# EAGLE design Kompass_MainframePTH (EAGLE 9.3.0)

## Sheet 1 of 2
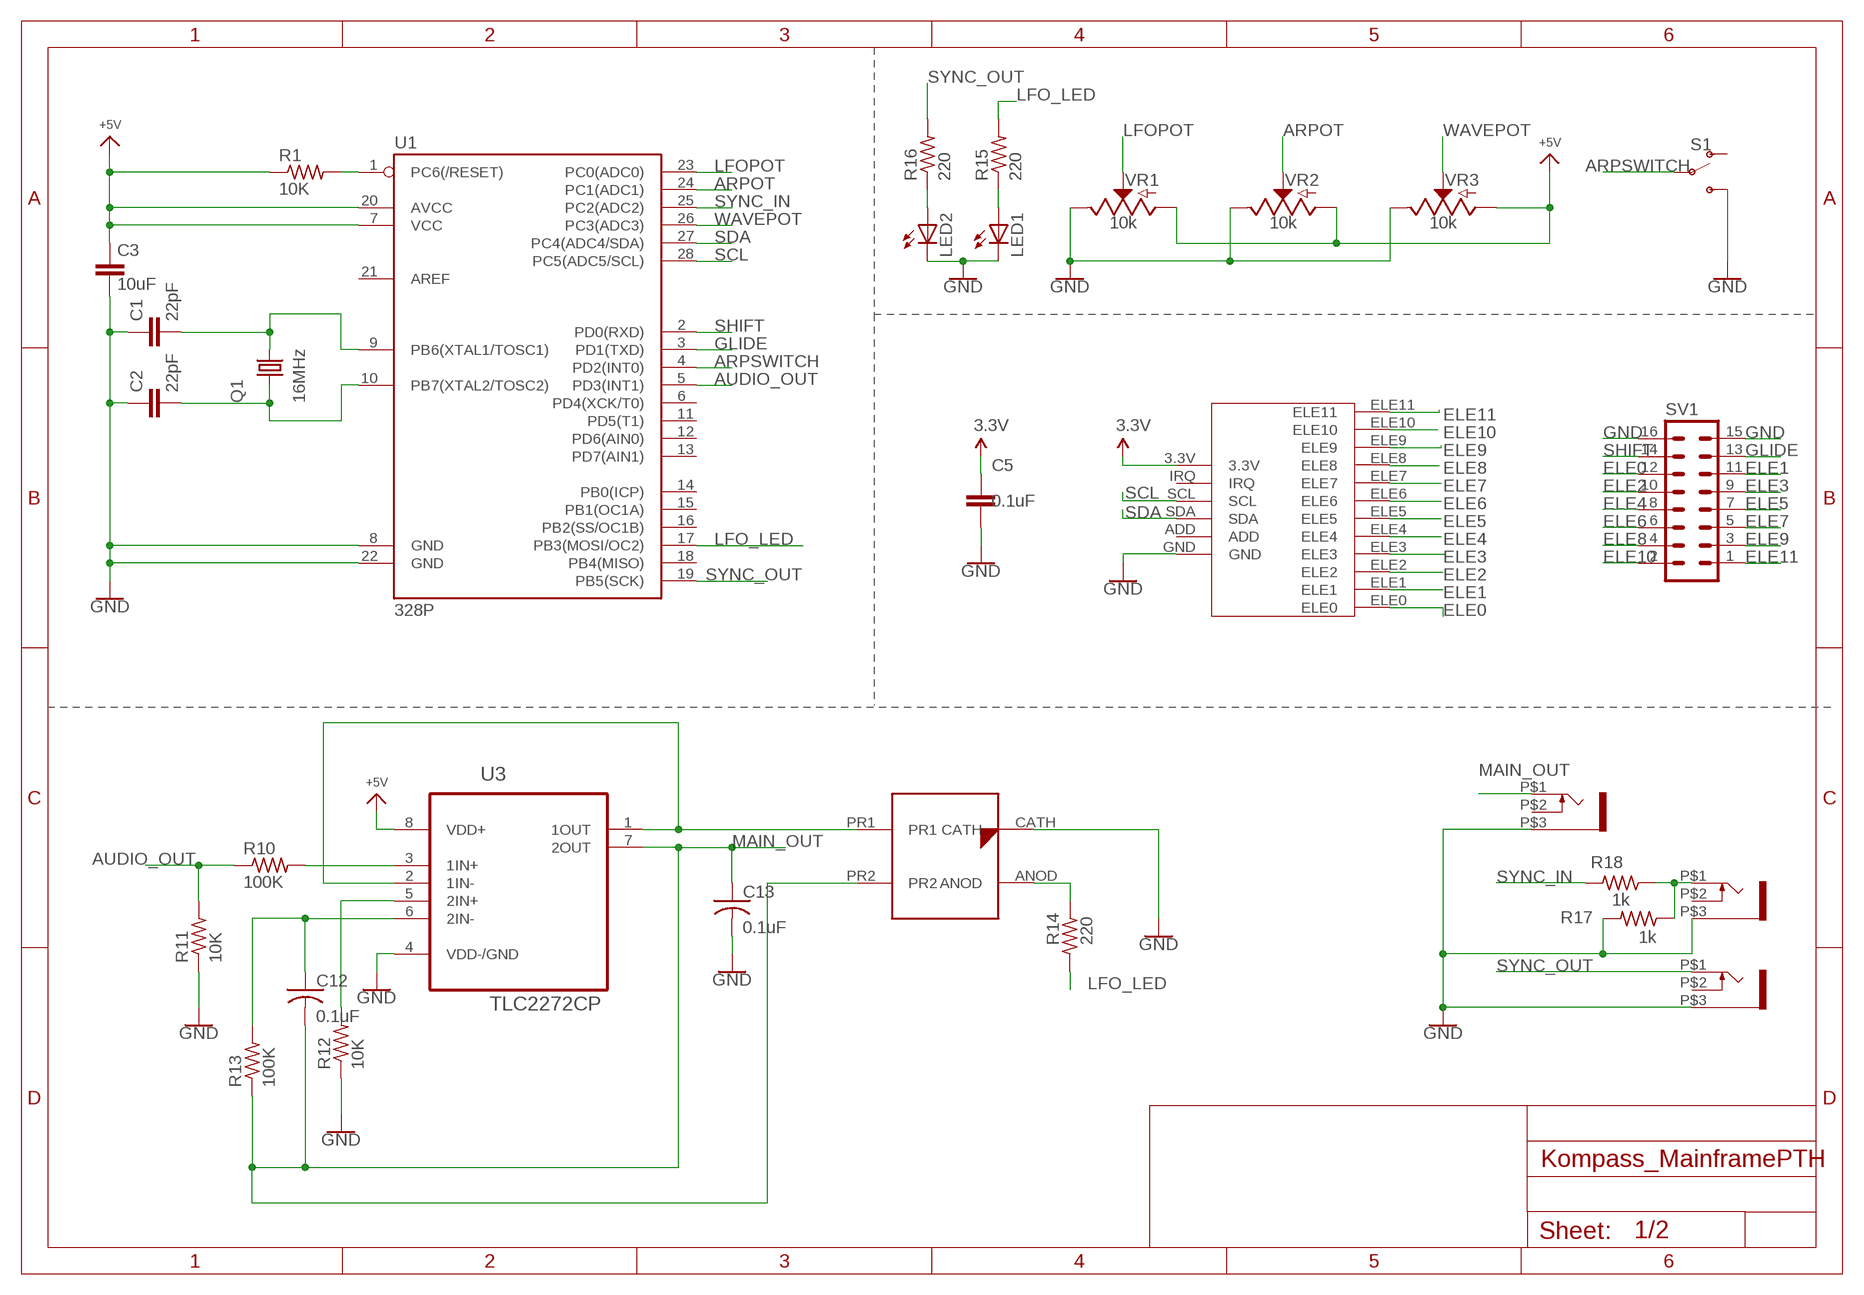
[diagram p0: schematic, sheet 1]

### Parts
C1  22pF  C2,5-3  [C2.5-3]
C2  22pF  C2,5-3  [C2.5-3]
C3  10uF  C-EU025-025X050  [C025-025X050]
C5  0.1uF  C2,5-3  [C2.5-3]
C12  0.1uF  C-US025-024X044  [C025-024X044]
C13  0.1uF  C-US025-024X044  [C025-024X044]
LED1  LED3MM  [LED3MM]
LED2  LED3MM  [LED3MM]
Q1  16MHz  CRYSTALHC49S  [HC49/S]
R1  10K  R-US_0204/5  [0204/5]
R10  100K  R-US_0204/5  [0204/5]
R11  10K  R-US_0204/5  [0204/5]
R12  10K  R-US_0204/5  [0204/5]
R13  100K  R-US_0204/5  [0204/5]
R14  220  R-US_0204/5  [0204/5]
R15  220  R-US_0204/5  [0204/5]
R16  220  R-US_0204/5  [0204/5]
R17  1k  R-US_0204/5  [0204/5]
R18  1k  R-US_0204/5  [0204/5]
S1  SWITCH-SPDT-PTH-11.6X4.0MM  [SWITCH_SPDT_PTH_11.6X4.0MM]
SV1  MA08-2  [MA08-2]
U1  328P  ATMEGA328P_PDIP  [DIP28]
U3  TLC2272CP  [DIP254P762X508-8]
U$1  BOCUMA_VACTROLBMA_VACTROL_PTH  [BOCUMA_VACTROL]
U$2  WQP-PJ301M-12_JACK  [WQP-PJ301M-12_JACK]
U$3  WQP-PJ301M-12_JACK  [WQP-PJ301M-12_JACK]
U$4  WQP-PJ301M-12_JACK  [WQP-PJ301M-12_JACK]
U$6  MPR121_BREAKOUT  [MPR121_BREAKOUT]
VR1  10k  POTENTIOMETER-PTH-9MM-1/20W-20%  [POT-PTH-ALPS]
VR2  10k  POTENTIOMETER-PTH-9MM-1/20W-20%  [POT-PTH-ALPS]
VR3  10k  POTENTIOMETER-PTH-9MM-1/20W-20%  [POT-PTH-ALPS]

### Nets
3.3V: C5.1 U$6.3.3V ; also sheet 2
ARPOT: U1.24(PC1(ADC1)) VR2.P$2(S)
ARPSWITCH: S1.2(P) U1.4(PD2(INT0))
AUDIO_OUT: R10.1 R11.2 U1.5(PD3(INT1))
ELE0: SV1.12 U$6.ELE0
ELE1: SV1.11 U$6.ELE1
ELE2: SV1.10 U$6.ELE2
ELE3: SV1.9 U$6.ELE3
ELE4: SV1.8 U$6.ELE4
ELE5: SV1.7 U$6.ELE5
ELE6: SV1.6 U$6.ELE6
ELE7: SV1.5 U$6.ELE7
ELE8: SV1.4 U$6.ELE8
ELE9: SV1.3 U$6.ELE9
ELE10: SV1.2 U$6.ELE10
ELE11: SV1.1 U$6.ELE11
GLIDE: SV1.13 U1.3(PD1(TXD))
GND: C1.1 C2.1 C3.2 C5.2 C13.2 LED1.K(C) LED2.K(C) R11.1 R12.1 R17.2 S1.3(S) SV1.15 SV1.16 U1.8(GND) U1.22(GND) U3.4(VDD-/GND) U$1.CATH U$2.P$3 U$3.P$3 U$4.P$3 U$6.GND VR1.P$1(E) VR2.P$1(E) VR3.P$1(E) ; also sheet 2
LFO_LED: R14.1 R15.2 U1.17(PB3(MOSI/OC2))
LFOPOT: U1.23(PC0(ADC0)) VR1.P$2(S)
MAIN_OUT: C12.2 C13.1 R13.1 U3.7(2OUT) U$1.PR2 U$4.P$1
N$1: C1.2 Q1.2 U1.9(PB6(XTAL1/TOSC1))
N$2: C2.2 Q1.1 U1.10(PB7(XTAL2/TOSC2))
N$3: R1.2 U1.1(PC6(/RESET))
N$6: C12.1 R13.2 U3.6(2IN-)
N$7: R12.2 U3.5(2IN+)
N$8: U3.1(1OUT) U3.2(1IN-) U$1.PR1
N$9: R10.2 U3.3(1IN+)
N$10: R14.2 U$1.ANOD
N$11: LED1.A R15.1
N$12: LED2.A R16.1
N$13: R17.1 R18.1 U$2.P$1
SCL: U1.28(PC5(ADC5/SCL)) U$6.SCL
SDA: U1.27(PC4(ADC4/SDA)) U$6.SDA
SHIFT: SV1.14 U1.2(PD0(RXD))
SYNC_IN: R18.2 U1.25(PC2(ADC2))
SYNC_OUT: R16.2 U1.19(PB5(SCK)) U$3.P$1
VCC: C3.1 R1.1 U1.7(VCC) U1.20(AVCC) U3.8(VDD+) VR1.P$3(A) VR2.P$3(A) VR3.P$3(A) ; supply symbol labelled +5V ; also sheet 2
WAVEPOT: U1.26(PC3(ADC3)) VR3.P$2(S)
Unconnected: S1.1(O) U1.6(PD4(XCK/T0)) U1.11(PD5(T1)) U1.12(PD6(AIN0)) U1.13(PD7(AIN1)) U1.14(PB0(ICP)) U1.15(PB1(OC1A)) U1.16(PB2(SS/OC1B)) U1.18(PB4(MISO)) U1.21(AREF) U$2.P$2 U$3.P$2 U$4.P$2 U$6.ADD U$6.IRQ

## Sheet 2 of 2
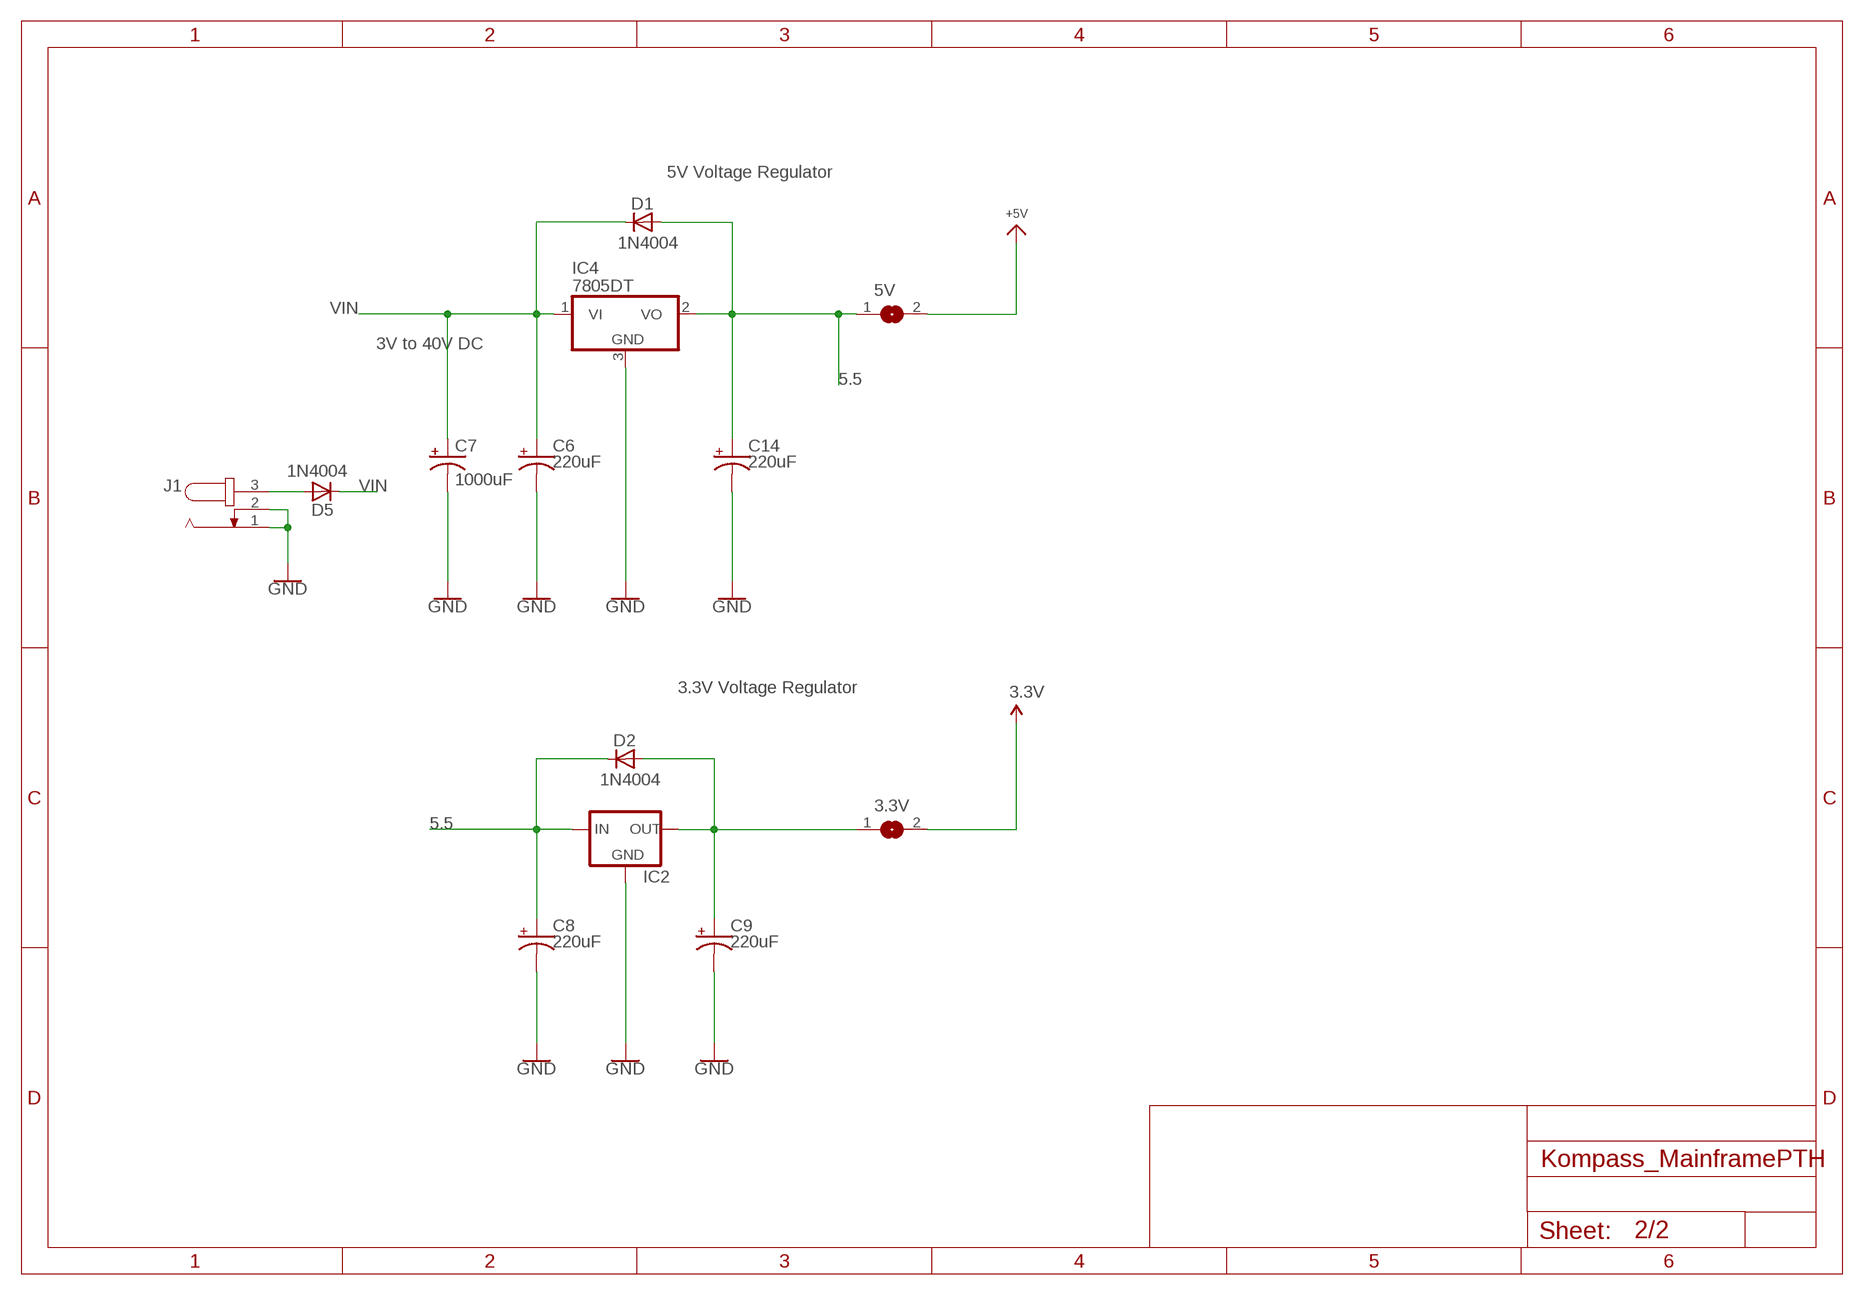
[diagram p1: schematic, sheet 2]

### Parts
3.3V  SJW  [SJW]
5V  SJW  [SJW]
C6  220uF  CPOL-USE2,5-6E  [E2,5-6E]
C7  1000uF  CPOL-USE3.5-8  [E3,5-8]
C8  220uF  CPOL-USE2,5-6E  [E2,5-6E]
C9  220uF  CPOL-USE2,5-6E  [E2,5-6E]
C14  220uF  CPOL-USE2,5-6E  [E2,5-6E]
D1  1N4004  [DO41-10]
D2  1N4004  [DO41-10]
D5  1N4004  [DO41-10]
IC2  78LXX  [78LXX]
IC4  7805DT  [TO252]
J1  JACK-PLUG0  [SPC4077]

### Nets
3.3V: 3.3V.2 ; also sheet 1
5.5: 5V.1 C8.+ C14.+ D1.A D2.C IC2.IN IC4.2(VO)
GND: C6.- C7.- C8.- C9.- C14.- IC2.GND IC4.3(GND) J1.1 J1.2 ; also sheet 1
N$4: D5.A J1.3
N$15: 3.3V.1 C9.+ D2.A IC2.OUT
VCC: 5V.2 ; supply symbol labelled +5V ; also sheet 1
VIN: C6.+ C7.+ D1.C D5.C IC4.1(VI)

### Notes on the sheet
- 5V Voltage Regulator
- 3V to 40V DC
- 3.3V Voltage Regulator

## Library data of the parts
3.3V 5V = jumper:SJ: SMD solder JUMPER
C1 C2 C5 = capacitor-wima:C: CAPACITOR naming: grid - package width
C3 = rcl:C-EU: CAPACITOR, European symbol; SPICEPREFIX: C
C6 C8 C9 C14 = rcl:CPOL-US: POLARIZED CAPACITOR, American symbol; SPICEPREFIX: C
C7 = adafruit:CPOL-US: POLARIZED CAPACITOR, American symbol
C12 C13 = adafruit:C-US: CAPACITOR, American symbol
D1 D2 D5 = adafruit:1N4004: DIODE General purpose 1N400x type rectifier (With bigger pads) http://www.ladyada.net/library/pcb/eaglelibrary.html
IC2 = DC_LOAD_AU:78LXX: VOLTAGE REGULATOR
IC4 = adafruit:78*: Positive VOLTAGE REGULATOR Added bigger pads to the TO-92 package
J1 = con-jack:JACK-PLUG: DC POWER JACK Power Jack, DC, Right Angle, Through Hole, Rated 5A at 16VDC, PC Terminals Distributor: Farnell (www.Farnell.de) Drawing: 84N1161.pdf / 84N1162.pdf Manufacturer: SPC Technology (www.spctechnology.com) Type: SPC4077 / SPC 4078; OC_FARNELL: unknown; OC_NEWARK: unknown
LED1 LED2 = adafruit:LED: LED OSRAM: - CHIPLED LG R971, LG N971, LY N971, LG Q971, LY Q971, LO R971, LY R971 LH N974, LH R974 LS Q976, LO Q976, LY Q976 LO Q996 - Hyper CHIPLED LW Q18S LB Q993, LB Q99A, LB R99A - SideLED LS A670, LO A670, LY A670, LG A670, LP A670 LB A673, LV A673, LT A673, LW A673 LH A674 LY A675 LS A676, LA A676, LO A676, LY A676, LW A676 LS A679, LY A679, LG A679 - Hyper Micro SIDELED® LS Y876, LA Y876, LO Y876, LY Y876 LT Y87S - SmartLED LW L88C, LW L88S LB L89C, LB L89S, LG L890 LS L89K, LO L89K, LY L89K LS L896, LA L896, LO L896, LY L896 - TOPLED LS T670, LO T670, LY T670, LG T670, LP T670 LSG T670, LSP T670, LSY T670, LOP T670, LYG T670 LG T671, LOG T671, LSG T671 LB T673, LV T673, LT T673, LW T673 LH T674 LS T676, LA T676, LO T676, LY T676, LB T676, LH T676, LSB T676, LW T676 LB T67C, LV T67C, LT T67C, LS T67K, LO T67K, LY T67K, LW E67C LS E67B, LA E67B, LO E67B, LY E67B, LB E67C, LV E67C, LT E67C LW T67C LS T679, LY T679, LG T679 LS T770, LO T770, LY T770, LG T770, LP T770 LB T773, LV T773, LT T773, LW T773 LH T774 LS E675, LA E675, LY E675, LS T675 LS T776, LA T776, LO T776, LY T776, LB T776 LHGB T686 LT T68C, LB T68C - Hyper Mini TOPLED® LB M676 - Mini TOPLED Santana® LG M470 LS M47K, LO M47K, LY M47K Source: http://www.osram.convergy.de/
Q1 = crystal:CRYSTAL: CRYSTAL; OC_FARNELL: 1667008; OC_NEWARK: unknown
R1 R10-R18 = adafruit:R-US_: RESISTOR, American symbol
S1 = SparkFun-Switches:SWITCH-SPDT: Single Pole, Double Throw (SPDT) Switch Single-pole, double-throw (SPDT) switch. Variant Overview SMD-AYZ0202 Surface Mount DPDT Switch <https://www.sparkfun.com/products/597> (COM-00597) Used on e.g. LilyPad Arduino USB - ATmega32U4 Board <https://www.sparkfun.com/products/12049> PTH-11.6X4.0MM SPDT Mini Power Switch <https://www.sparkfun.com/products/102> (COM-00102) Used on e.g. SparkFun Simon Says - Through-Hole Soldering Kit <https://www.sparkfun.com/products/10547> (KIT-10547) PTH-11.6X4.0MM-KIT KIT version of SPDT Mini Power Switch - Simplifies soldering by removing tStop of switch pins - only one side can be soldered. PTH-11.6X4.0MM-LOCK LOCK version of SPDT Mini Power Switch - Offset pins hold switch in place for easier soldering. SMD-RIGHT-ANGLE Surface Mount Right Angle Switch <https://www.sparkfun.com/products/10860> (COM-10860) Used on e.g. SparkFun ESP8266 Thing <https://www.sparkfun.com/products/13231>; PROD_ID: SWCH-08261; SF_SKU: COM-00102
SV1 = con-lstb:MA08-2: PIN HEADER; OC_FARNELL: unknown; OC_NEWARK: unknown
U1 = SparkFun-IC-Microcontroller:ATMEGA328P_PDIP: Atmel 328P Through hole ATMEGA328P uC used in the Arduino 32kb flash, 1k EEPROM, 2k SRAM Datasheet <http://www.sparkfun.com/datasheets/Components/SMD/ATMega328.pdf> SparkFun Products Storefront component: AVR 28 Pin 20MHz 32K 6A/D - ATMega328P <https://www.sparkfun.com/products/9061> (COM-09061) SparkFun Simon Says - Through-Hole Soldering Kit <https://www.sparkfun.com/products/10547> (KIT-10547) SparkFun Learn to Solder - Simon Says <https://www.sparkfun.com/products/13708> (KIT-13708) SparkFun BigTime Watch Kit <https://www.sparkfun.com/products/11734> (KIT-11734) SparkFun ClockIt <https://www.sparkfun.com/products/10930> (KIT-10930) SparkFun Serial Enabled LCD Kit <https://www.sparkfun.com/products/10097> (LCD-10097) SparkFun Simon Tilts - Through Hole Soldering Kit <https://www.sparkfun.com/products/12634> (KIT-12634) SparkFun Frequency Counter Kit <https://www.sparkfun.com/products/10140> (KIT-10140) FabFM Radio Kit <https://www.sparkfun.com/products/11043> (KIT-11043) SparkFun Binary Blaster Kit <https://www.sparkfun.com/products/12037> (KIT-12037) SparkFun Metro-Gnome <https://www.sparkfun.com/products/9236> (KIT-09236) ATmega328 with Arduino Optiboot (Uno) <https://www.sparkfun.com/products/10524> (DEV-10524); PROD_ID: IC-09136
U3 = TLC2272CP:TLC2272CP: OPERATIONAL AMPLIFIER; AVAILABILITY: Unavailable; DESCRIPTION: Dual Low-Noise Rail-To-Rail Operational Amplifier 8-PDIP 0 to 70; MF: Texas Instruments; MP: TLC2272CP; PACKAGE: PDIP-8 Texas Instruments; PRICE: None
U$1 = BOCUMA_VACTROL:BOCUMA_VACTROL
U$2-U$4 = thonkiconn:WQP-PJ301M-12_JACK
U$6 = Bocuma_UserInterfaceTools:MPR121_BREAKOUT
VR1-VR3 = SparkFun-Resistors:POTENTIOMETER: Potentiometer (Pot) Three-terminal potentiometers, with an adjustable wiper and two adjustable resistors. A pot can be used to create a configurable voltage divider, or as a variable resistor. Variants ALPS_POT and ALPS_POT_KIT - PTH, breadboard compatible, 9mm square pots Rotary Potentiometer - Linear (10k ohm) <https://www.sparkfun.com/products/9288> (COM-09288) The KIT variant exposes copper on only one side of the PTH pad, so the part can only be assembled on one side of the PCB. Useful for beginner soldering kits.; PROD_ID: RES-09177; SF_SKU: COM-09288

## Board
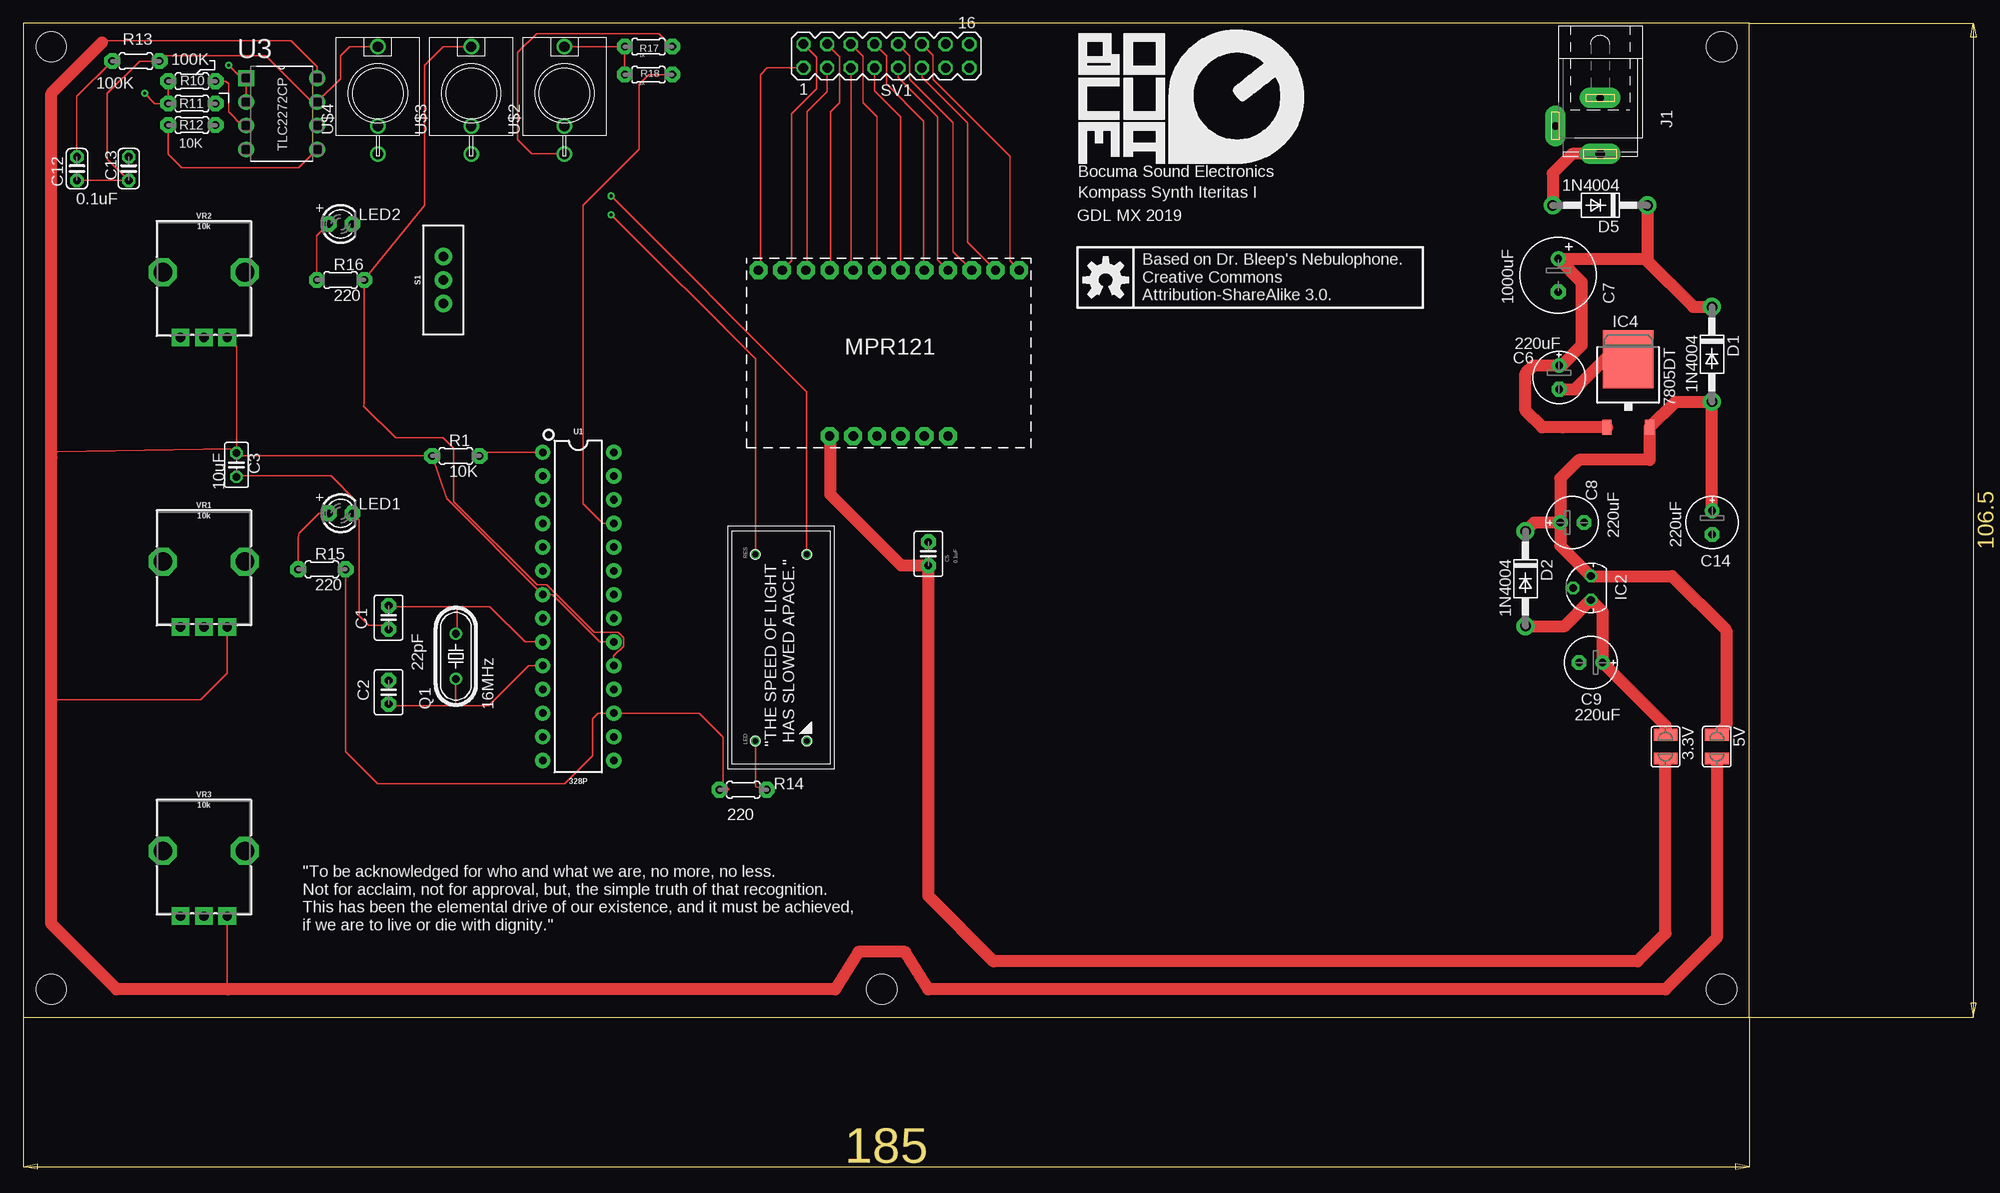
[diagram p2: board, top side]
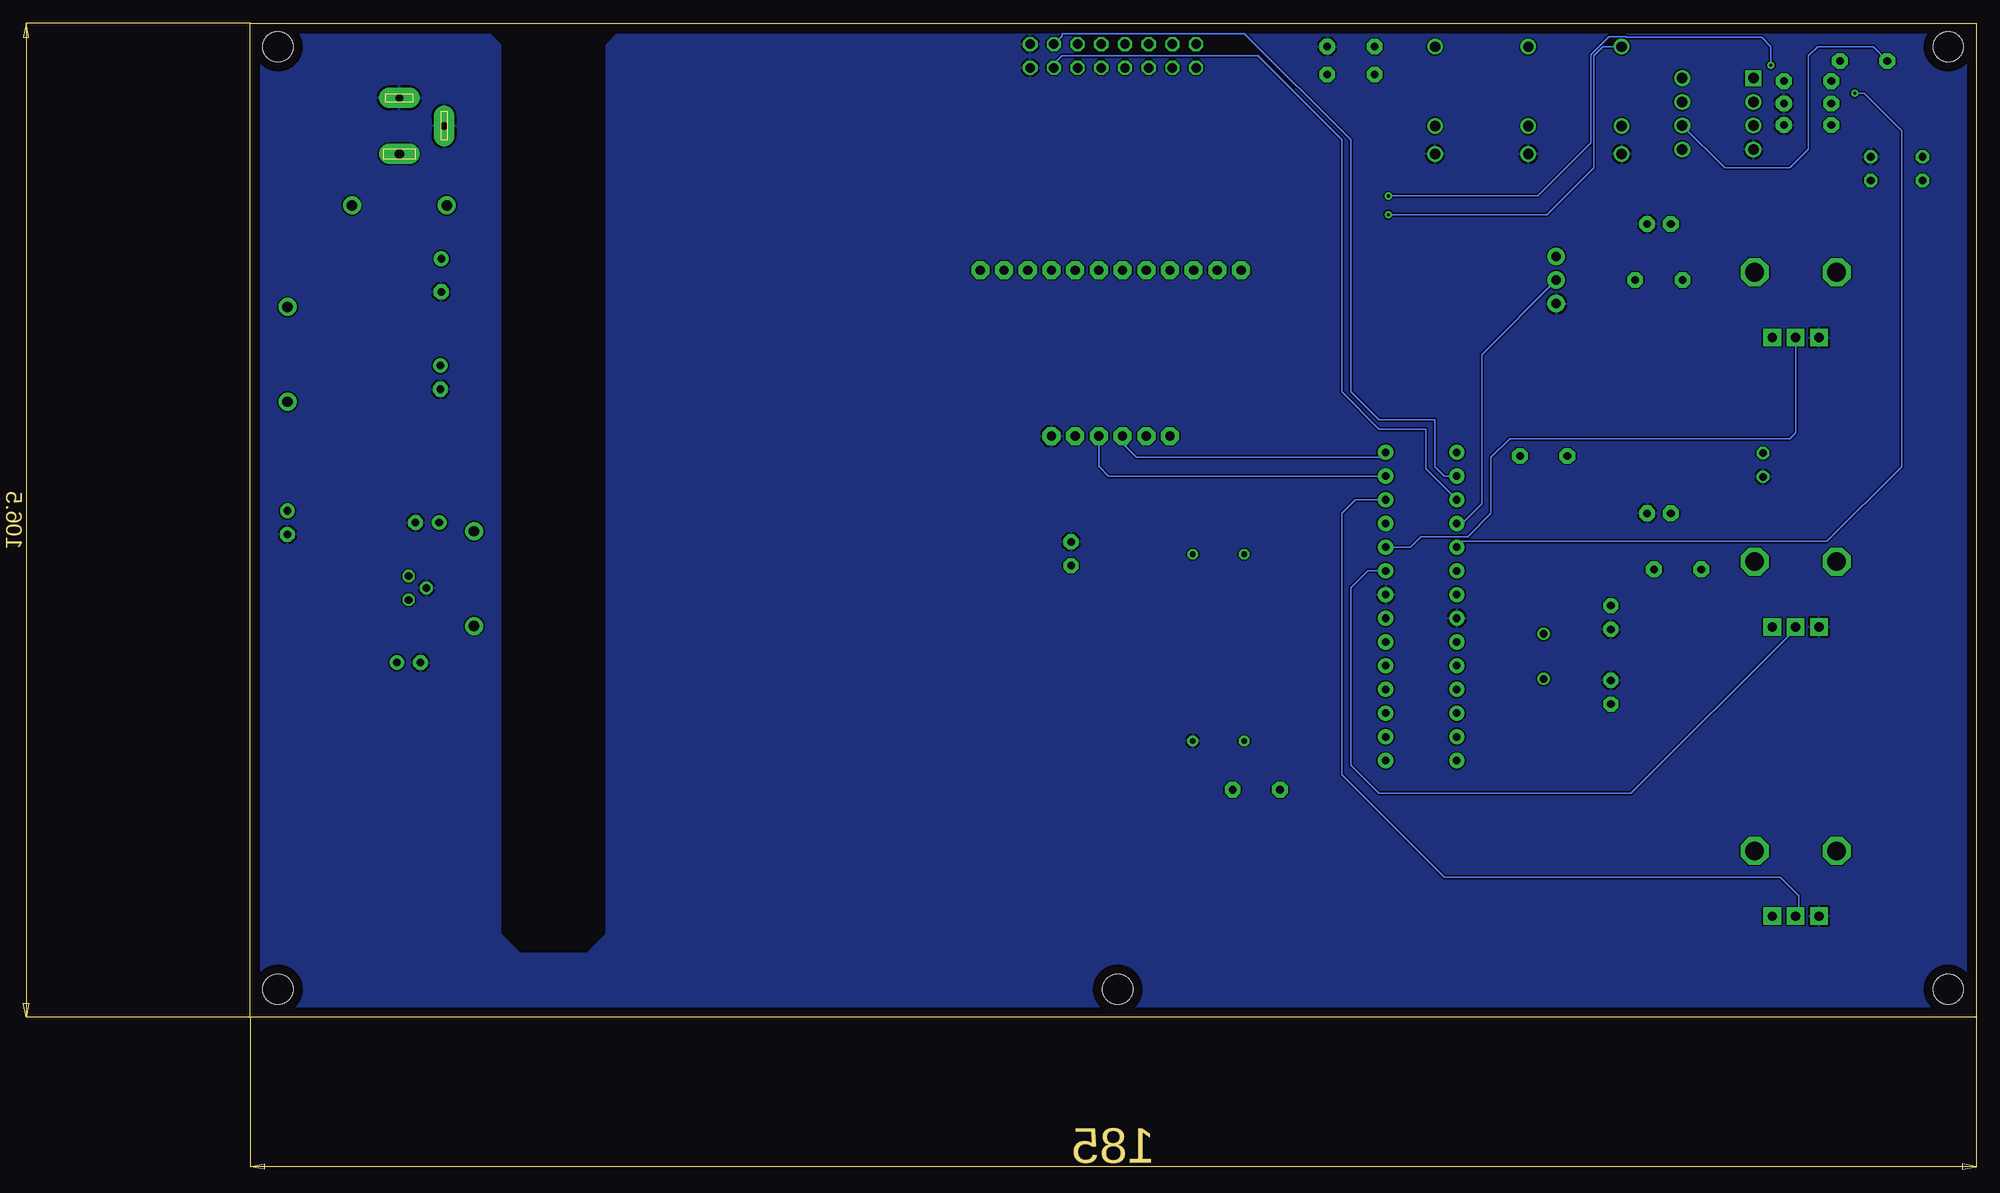
[diagram p3: board, bottom side, seen from below]

Size 185 x 106.5 mm. Coordinates in mm from the lower left corner, seen from the top.
Outline: 0,0 185,0 185,106.5 0,106.5 0,0
Copper layers (1*16): Top 0.035mm / dielectric 1.5mm / Bottom 0.035mm
Design rules "default": minimum track width 6mil, minimum drill 0.35mm, track to track 6mil, track to pad 6mil, pad to pad 6mil, via to via 6mil, smd to smd 6mil, copper to edge 40mil, drill to drill 6mil, minimum pad ring 10mil, minimum via ring 8mil, stop-mask expansion 4mil, vias tented up to drill 0mil, thermal gap 10mil
Holes 3.25 mm at 3,104 182,104 182,3 92,3 3,3
tRestrict: area 147,7 to 158,106
bRestrict: area 147,7 to 158,106

### Footprints (pad centres in the part's own frame; a part is rotated, then mirrored left to right if it is on the bottom)
SJW = smd 1.27 x 2.54: 1 -1.27,0; 2 1.27,0
C2.5-3 = drill 0.813 pad 1.6 octagon: 1 -1.27,0; 2 1.27,0
C025-025X050 = drill 0.813 octagon: 1 -1.27,0; 2 1.27,0
E2,5-6E = drill 0.813 pad 1.575: + -1.27,0 | drill 0.813 pad 1.575 octagon: - 1.27,0
E3,5-8 = drill 0.813 pad 1.6: + -1.778,0 | drill 0.813 pad 1.6 octagon: - 1.778,0
C025-024X044 = drill 0.813 pad 1.422 octagon: 1 -1.27,0; 2 1.27,0
DO41-10 = drill 1.118 pad 1.93: A 5.08,0; C -5.08,0
78LXX = drill 0.813 octagon: GND 0,1.905; IN 1.27,0; OUT -1.27,0
TO252 = smd 1 x 1.6: 1 -2.28,-4.8; 2 2.28,-4.8 | smd 5.4 x 6.2: 3 0,2.5
SPC4077 = drill 0.8 pad 2.184 long: 1 -3,0; 2 0,-4.8 | drill 1 pad 2.184 long: 3 3,0
LED3MM = drill 0.813 pad 1.676 octagon: A -1.27,0; K 1.27,0
HC49/S = drill 0.813: 1 -2.413,0; 2 2.413,0
0204/5 = drill 0.813 pad 1.676 octagon: 1 -2.54,0; 2 2.54,0
SWITCH_SPDT_PTH_11.6X4.0MM = drill 1.016 pad 1.88: 1 0,2.54; 2 0,0; 3 0,-2.54
MA08-2 = drill 1.016 octagon: 1 -8.89,-1.27; 2 -8.89,1.27; 3 -6.35,-1.27; 4 -6.35,1.27; 5 -3.81,-1.27; 6 -3.81,1.27; 7 -1.27,-1.27; 8 -1.27,1.27; 9 1.27,-1.27; 10 1.27,1.27; 11 3.81,-1.27; 12 3.81,1.27; 13 6.35,-1.27; 14 6.35,1.27; 15 8.89,-1.27; 16 8.89,1.27
DIP28 = drill 0.813 pad 1.626: 1 -16.51,-3.81; 2 -13.97,-3.81; 3 -11.43,-3.81; 4 -8.89,-3.81; 5 -6.35,-3.81; 6 -3.81,-3.81; 7 -1.27,-3.81; 8 1.27,-3.81; 9 3.81,-3.81; 10 6.35,-3.81; 11 8.89,-3.81; 12 11.43,-3.81; 13 13.97,-3.81; 14 16.51,-3.81; 15 16.51,3.81; 16 13.97,3.81; 17 11.43,3.81; 18 8.89,3.81; 19 6.35,3.81; 20 3.81,3.81; 21 1.27,3.81; 22 -1.27,3.81; 23 -3.81,3.81; 24 -6.35,3.81; 25 -8.89,3.81; 26 -11.43,3.81; 27 -13.97,3.81; 28 -16.51,3.81
DIP254P762X508-8 = drill 1.118 square: 1 -7.62,7.62 | drill 1.118: 2 -7.62,5.08; 3 -7.62,2.54; 4 -7.62,0; 5 0,0; 6 0,2.54; 7 0,5.08; 8 0,7.62
BOCUMA_VACTROL = drill 0.6 octagon: ANOD 23,3; CATH 23,8.5; PR1 3,8.5; PR2 3,3
WQP-PJ301M-12_JACK = drill 1.1: P$1 0,5; P$2 0,-3.5; P$3 0,-6.5
MPR121_BREAKOUT = drill 1 pad 1.93 octagon: 3.3V 1.27,21.59; ADD 1.27,11.43; ELE0 19.05,1.27; ELE1 19.05,3.81; ELE2 19.05,6.35; ELE3 19.05,8.89; ELE4 19.05,11.43; ELE5 19.05,13.97; ELE6 19.05,16.51; ELE7 19.05,19.05; ELE8 19.05,21.59; ELE9 19.05,24.13; ELE10 19.05,26.67; ELE11 19.05,29.21; GND 1.27,8.89; IRQ 1.27,19.05; SCL 1.27,16.51; SDA 1.27,13.97
POT-PTH-ALPS = drill 1 pad 1.88 square: P$1 7,-2.5; P$2 7,0; P$3 7,2.5 | drill 2 octagon: P$4 0,-4.4; P$5 0,4.4

### Placement (x,y rotation side)
3.3V  176,29 270 top
5V  181.5,29 270 top
C1  39.15,42.83 90 top
C2  39.15,34.83 270 top
C3  22.85,59.18 270 top
C5  97,49.66 90 top
C6  164.6,68.56 270 top
C7  164.5,79.5 270 top
C8  166,53 0 top
C9  168,38 180 top
C12  5.75,90.93 270 top
C13  11.3,90.93 90 top
C14  181,53 270 top
D1  180.98,71.03 270 top
D2  161,47 270 top
D5  169,87 180 top
IC2  168,46 90 top
IC4  172,68 0 top
J1  169,95.5 270 top
LED1  34,54 0 top
LED2  34,85 0 top
Q1  46.36,38.68 90 top
R1  46.36,60.15 0 top
R10  18.07,100.3 0 top
R11  18.07,97.9 180 top
R12  18.07,95.6 180 top
R13  12.07,102.45 180 top
R14  77.16,24.38 0 top
R15  32,48 0 top
R16  34,79 0 top
R17  67,104 0 top
R18  67,101 0 top
S1  45,79 0 top
SV1  92.5,103 0 top
U1  59.48,44.02 270 top
U3  31.5,93 0 top
U$1  75.46,52.61 270 top
U$2  58,99 0 top
U$3  48,99 0 top
U$4  38,99 0 top
U$5  [OSHW-LOGO-M]  116,79 0 top
U$6  108,61 90 top
VR1  19.35,48.83 270 top
VR2  19.35,79.83 270 top
VR3  19.35,17.83 270 top

### Tracks (layer width: path | path; a pad name or v marks a point on that pad's centre or on a via)
3.3V
  Top 1.27: 3.3V.2 176,9 173,6 104,6 97,13 C5.1 94.11,48.39 86.5,56 86.5,62.18 U$6.3.3V
5.5
  Top 1.27: C8.+ 161.92,53 D2.C | C8.+ 164.73,50.54 IC2.IN 176.73,47.27 182.5,41.5 182.5,31.27 5V.1 | C14.+ 180.98,54.29 D1.A 177.03,65.95 IC4.2 174.28,59.72 166.72,59.72 164.73,57.73 C8.+
ARPOT
  Bottom 0.152: U1.24 60.63,50.37 59.5,51.5 54.5,51.5 52,54 52,60 50,62 20,62 19.35,62.65 VR2.P$2
ARPSWITCH
  Bottom 0.152: S1.2 53,71 53,55 55.09,52.91 U1.4
AUDIO_OUT  (via drill 0.35 pad 0.55)
  Top 0.152: v13,99 14.1,97.9 R11.2 R10.1
  Bottom 0.152: v13,99 12,99 8,95 8,59 16,51 55.04,51 U1.5
ELE0
  Top 0.152: SV1.12 97.5,103.08 97.5,100.5 105.73,92.27 105.73,81.05 U$6.ELE0
ELE1
  Top 0.152: SV1.11 96.31,100.73 101.19,95.85 101.19,83.05 U$6.ELE1
ELE2
  Top 0.152: SV1.10 95,103.04 95,100.5 99.65,95.85 99.65,82.05 U$6.ELE2
ELE3
  Top 0.152: SV1.9 93.77,100.73 98,96.5 98,81.16 U$6.ELE3
ELE4
  Top 0.152: SV1.8 92.5,103 92.5,100 96.5,96 96.5,80.12 U$6.ELE4
ELE5
  Top 0.152: SV1.7 91.23,99.27 94.03,96.47 U$6.ELE5
ELE6
  Top 0.152: SV1.6 90,102.96 90,98 91.5,96.5 U$6.ELE6
ELE7
  Top 0.152: SV1.5 88.69,80.31 U$6.ELE7
ELE8
  Top 0.152: SV1.4 87.5,102.92 87.5,98 86.5,97 86.5,80.14 U$6.ELE8
ELE9
  Top 0.152: SV1.3 86.15,99.15 84,97 84,80.18 U$6.ELE9
ELE10
  Top 0.152: SV1.2 85,102.88 85,99.5 82.33,96.83 82.33,81.05 U$6.ELE10
ELE11
  Top 0.152: SV1.1 79.73,101.73 79,101 79,80.26 U$6.ELE11
GLIDE
  Bottom 0.152: SV1.13 98.85,102.15 98,103 77,103 68,94 68,67 64,63 59,63 59,58.78 U1.3
GND
  Top 0.152: 35.63,53.63 36,53.27 36,43 37,42 38.71,42 C1.1 | 35.63,53.63 LED1.K | C3.2 23.08,58 33,58 35.63,55.37 35.63,53.63 | R17.2 68.13,105.41 55,105.41 53,103.41 53,94 54.5,92.5 U$2.P$3
  Top 1.27: C6.- 166.29,67.29 170,71 171.5,71 IC4.3
  pour Bottom: 0,106 145,106 147,104 147,9 149,7 156,7 158,9 158,104 160,106 184,106 184,1 0,1
LFO_LED
  Top 0.152: R14.1 75.62,24.38 75,25 75,30 72.41,32.59 U1.17 61.59,32.59 61,32 61,28 58,25 38,25 34.58,28.42 34.54,28.43 R15.2
LFOPOT
  Bottom 0.152: U1.23 65.17,47.83 67,46 67,27 64,24 37,24 19.35,41.65 VR1.P$2
MAIN_OUT  (via drill 0.35 pad 0.55)
  Top 0.152: v63,86 78.46,70.54 U$1.PR2 | C12.2 C13.1 9,91.96 9,99 12.45,102.45 R13.1 15.16,103 26,103 30.92,98.08 U3.7 34,100.58 34,103 35,104 U$4.P$1
  Bottom 0.152: U$4.P$1 40,104 41,103 41,91 46,86 v63,86
N$1
  Top 0.152: U1.9 53.79,40.21 50,44 46.5,44 | 46.5,44 46.5,41.23 Q1.2 | C1.2 39.37,44 46.5,44
N$2
  Top 0.152: U1.10 54.17,37.67 49.85,33.35 46.36,33.35 | 46.36,33.35 Q1.1 | 46.36,33.35 39.36,33.35 C2.2
N$3
  Top 0.152: U1.1 48.9,60.53 R1.2
N$4
  Top 1.27: J1.3 166,92.5 163.92,90.42 D5.A
N$6
  Top 0.152: C12.1 5.75,98.67 R13.2
  Bottom 0.152: U3.6 26.96,91 20,91 18,93 18,103 17,104 11,104 11,103.92 R13.2
N$7
  Top 0.152: U3.5 29.5,91 17,91 15.53,92.47 R12.2
N$8  (via drill 0.35 pad 0.55)
  Top 0.152: 22.02,101.97 v22,102 23.38,100.62 U3.1 U3.2 | v63,88 83.96,67.04 U$1.PR1
  Bottom 0.152: v63,88 47,88 41.3,93.69 41.3,103.13 39.38,105.05 37.56,105.05 37.51,105 23,105 22,104 v22,102
N$9
  Top 0.152: R10.2 21.7,100.3 22,100 22,97 23.46,95.54 U3.3
N$10
  Top 0.152: R14.2 78.46,24.68 U$1.ANOD
N$11
  Top 0.152: R15.1 29.46,51.42 29.59,51.86 31.73,54 LED1.A
N$12
  Top 0.152: R16.1 31.46,83.72 31.46,83.73 LED2.A
N$13
  Top 0.152: U$2.P$1 R17.1 R18.1
N$15
  Top 1.27: D2.A 165.19,41.92 IC2.OUT 169.27,43.46 C9.+ 176,31.27 3.3V.1
SCL
  Bottom 0.152: U$6.SCL 91.49,61.49 90,60 63.82,60 U1.28
SDA
  Bottom 0.152: U$6.SDA 94.03,59.03 92.99,57.99 U1.27
SHIFT
  Bottom 0.152: SV1.14 98,105.12 98,105.41 78.41,105.41 67,94 67,67 64,64 58,64 58,59 56.99,57.99 U1.2
SYNC_IN
  Top 0.152: U1.25 62.09,52.91 60,55 60,87 66,93 66,99.96 67.04,101 R18.2
SYNC_OUT
  Top 0.152: U$3.P$1 45,104 43,102 43,87 R16.2 36.54,65.8 36.5,65.46 39.88,62.08 45.01,62.08 46.14,60.95 46.14,55.25 55.06,46.33 56.1,46.33 61.18,41.25 63.72,41.25 64.33,40.64 64.33,39.78 63.29,38.74 U1.19
VCC
  Top 0.152: C3.1 22.87,60.15 R1.1 45.36,55.6 U1.7 56.71,45.29 61.79,40.21 U1.20 | VR3.P$3 21.85,3.15 22,3 | C3.1 22.85,71.83 VR2.P$3 | C3.1 22.38,60.92 3.61,60.61 3,60 | VR1.P$3 21.85,36.85 19,34 3,34 | U3.8 31.5,101.85 28.7,104.64 8.64,104.64 8.43,104.42 8.2,104.64
  Top 1.27: 8.43,104.42 3,99 3,60 3,34 3,10 10,3 22,3 87,3 89.5,7 94.5,7 97,3 176,3 181.5,8.5 5V.2
VIN
  Top 0.152: 165,63.2 164.73,62.93
  Top 1.27: D5.C 174.08,81.01 | D1.C 178.98,76.11 174.08,81.01 | 174.08,81.01 173.81,81.28 C7.+ 167,78.78 167,72 164.83,69.83 C6.+ 161.83,69.83 161,69 161,65 162.8,63.2 165,63.2 IC4.1
WAVEPOT
  Bottom 0.152: U1.26 66.55,55.45 68,54 68,26 57,15 21,15 19,13 19,11.18 VR3.P$2

### Text on the board
tNames: Bocuma Sound Electronics | Kompass Synth Iteritas I | GDL MX 2019 | Based on Dr. Bleep's Nebulophone. / Creative Commons / Attribution-ShareAlike 3.0. | MPR121 | "To be acknowledged for who and what we are, no more, no less. / Not for acclaim, not for approval, but, the simple truth of that recognition. / This has been the elemental drive of our existence, and it must be achieved, / if we are to live or die with dignity."